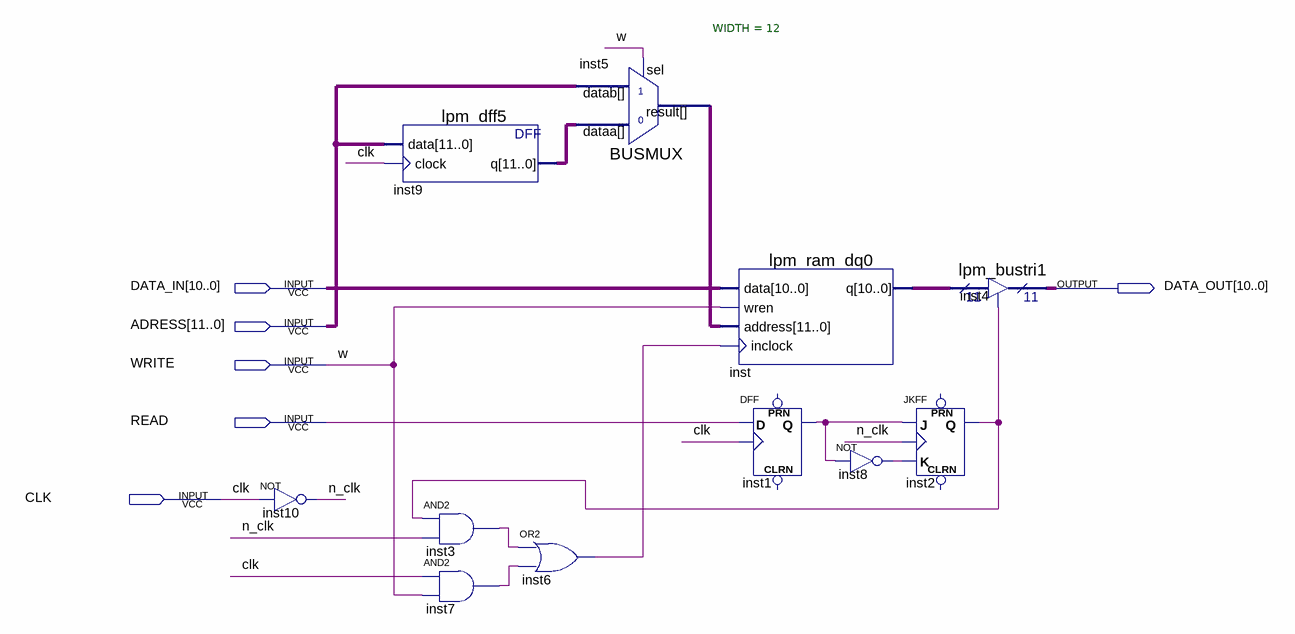
[diagram p0: schematic sheet]
// Quartus schematic RAM.bdf as structural Verilog: 11 symbols, 6 pins
module RAM (
  input  [10:0] DATA_IN,
  input  [11:0] ADRESS,
  input  WRITE,
  input  READ,
  input  CLK,
  output [10:0] DATA_OUT
);

  wire inst1_q, inst2_q, inst3_out, inst6_out, inst7_out, inst8_out, n_clk;
  wire [10:0] inst_q;
  wire [11:0] inst5_result, inst9_q;

  not inst10 (n_clk, CLK);
  lpm_dff5 inst9 (.data(ADRESS), .clock(CLK), .q(inst9_q));
  and inst3 (inst3_out, inst2_q, n_clk);
  and inst7 (inst7_out, CLK, WRITE);
  or inst6 (inst6_out, inst3_out, inst7_out);
  BUSMUX #(.WIDTH(12)) inst5 (.datab(ADRESS), .sel(WRITE), .dataa(inst9_q), .result(inst5_result));
  lpm_ram_dq0 inst (.data(DATA_IN), .wren(WRITE), .address(inst5_result), .inclock(inst6_out), .q(inst_q));
  DFF inst1 (.CLK(CLK), .D(READ), .Q(inst1_q));  // open: CLRN, PRN
  not inst8 (inst8_out, inst1_q);
  JKFF inst2 (.K(inst8_out), .J(inst1_q), .CLK(n_clk), .Q(inst2_q));  // open: PRN, CLRN
  lpm_bustri1 inst4 (.enabledt(inst2_q), .data(inst_q), .tridata(DATA_OUT));

  // Other names for the same wires on the sheet: w = WRITE
endmodule
